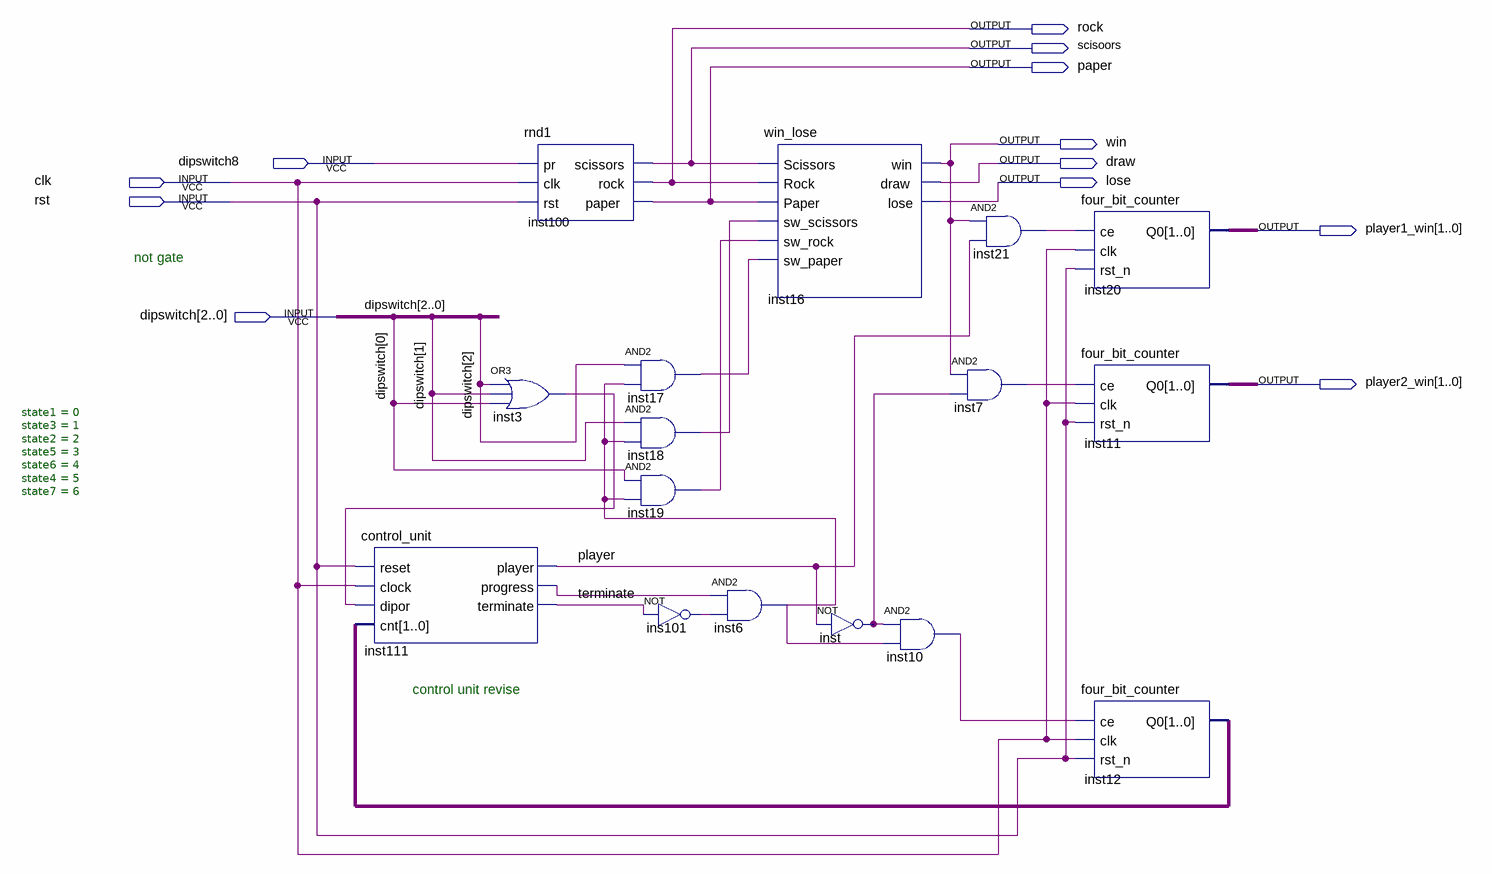
[diagram p0: schematic sheet]
// Quartus schematic project.bdf as structural Verilog: 16 symbols, 12 pins
module project (
  input  dipswitch8,
  input  clk,
  input  rst,
  input  [2:0] dipswitch,
  output rock,
  output scisoors,
  output paper,
  output win,
  output draw,
  output lose,
  output [1:0] player1_win,
  output [1:0] player2_win
);

  wire ins101_out, inst3_out, inst6_out, inst7_out, inst10_out, inst17_out, inst18_out, inst19_out,
       inst21_out, inst111_progress, inst_out, player, terminate;
  wire [1:0] inst12_q0;

  control_unit #(.state1(0), .state3(1), .state2(2), .state5(3), .state6(4), .state4(5), .state7(6)) inst111 (
    .reset(rst), .clock(clk), .dipor(inst3_out), .cnt(inst12_q0), .player(player),
    .progress(inst111_progress), .terminate(terminate));
  or inst3 (inst3_out, dipswitch[2], dipswitch[1], dipswitch[0]);
  rnd1 inst100 (.pr(dipswitch8), .clk(clk), .rst(rst), .scissors(scisoors), .rock(rock), .paper(paper));
  and inst17 (inst17_out, dipswitch[2], inst6_out);
  and inst18 (inst18_out, dipswitch[1], inst6_out);
  and inst19 (inst19_out, dipswitch[0], inst6_out);
  not ins101 (ins101_out, terminate);
  and inst6 (inst6_out, inst111_progress, ins101_out);
  win_lose inst16 (
    .Scissors(scisoors), .Rock(rock), .Paper(paper), .sw_scissors(inst18_out), .sw_rock(inst19_out),
    .sw_paper(inst17_out), .win(win), .draw(draw), .lose(lose));
  not inst (inst_out, player);
  and inst10 (inst10_out, inst_out, inst6_out);
  and inst7 (inst7_out, win, inst_out);
  and inst21 (inst21_out, win, player);
  four_bit_counter inst20 (.ce(inst21_out), .clk(clk), .rst_n(rst), .Q0(player1_win));
  four_bit_counter inst11 (.ce(inst7_out), .clk(clk), .rst_n(rst), .Q0(player2_win));
  four_bit_counter inst12 (.ce(inst10_out), .clk(clk), .rst_n(rst), .Q0(inst12_q0));

  // Notes on the sheet:
  //   not gate         
  //   control unit revise        
endmodule
